# Altium schematic sheet Lockbox_Schematic_V0.4.SchDoc
size A; SheetNumber: 1; SheetTotal: 1
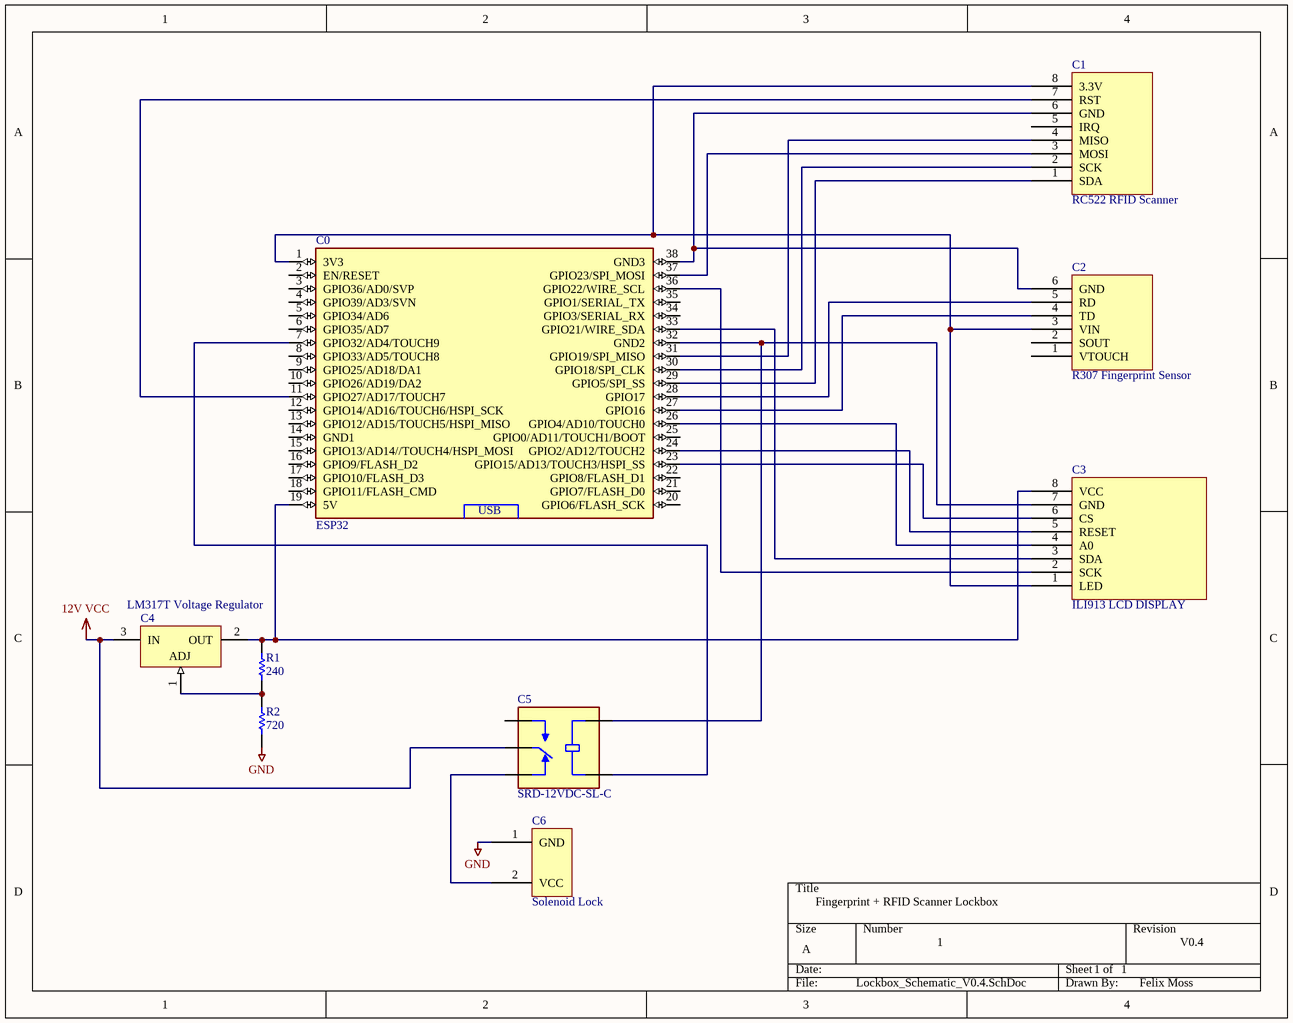
[diagram p0: Lockbox_Schematic_V0.4.SchDoc]

## Parts
C0  ESP32  [ESP32-DEVKITC]
C1  RC522 RFID Scanner
C2  R307 Fingerprint Sensor
C3  ILI913 LCD DISPLAY
C4  LM317T Voltage Regulator  [TO-220]
C5  SRD-12VDC-SL-C  [RELAY_SRD-12VDC-SL-C]
C6  Solenoid Lock  (mechanical)
R1  value 240  (hidden comment: Resistor)
R2  value 720  (hidden comment: Resistor)

## Nets
12V VCC: C4.3(IN) C5.COM
GND: C6.1(GND) R2.1
NetC0_1: C0.1(3V3) C1.8(3.3V) C2.3(VIN) C3.1(LED)
NetC0_7: C0.7(GPIO32/AD4/TOUCH9) C5.COIL1
NetC0_11: C0.11(GPIO27/AD17/TOUCH7) C1.7(RST)
NetC0_19: C0.19(5V) C3.8(VCC) C4.2(OUT) R1.1
NetC0_23: C0.23(GPIO15/AD13/TOUCH3/HSPI_SS) C3.6(CS)
NetC0_24: C0.24(GPIO2/AD12/TOUCH2) C3.5(RESET)
NetC0_26: C0.26(GPIO4/AD10/TOUCH0) C3.4(A0)
NetC0_27: C0.27(GPIO16) C2.4(TD)
NetC0_28: C0.28(GPIO17) C2.5(RD)
NetC0_29: C0.29(GPIO5/SPI_SS) C1.1(SDA)
NetC0_30: C0.30(GPIO18/SPI_CLK) C1.2(SCK)
NetC0_31: C0.31(GPIO19/SPI_MISO) C1.4(MISO)
NetC0_32: C0.32(GND2) C3.7(GND) C5.COIL2
NetC0_33: C0.33(GPIO21/WIRE_SDA) C3.3(SDA)
NetC0_36: C0.36(GPIO22/WIRE_SCL) C3.2(SCK)
NetC0_37: C0.37(GPIO23/SPI_MOSI) C1.3(MOSI)
NetC0_38: C0.38(GND3) C1.6(GND) C2.6(GND)
NetC4_1: C4.1(ADJ) R1.2 R2.2
NetC5_NC: C5.NC C6.2(VCC)

Not connected (* = marked no-connect by the designer): C0 2(EN/RESET) 3(GPIO36/AD0/SVP) 4(GPIO39/AD3/SVN) 5(GPIO34/AD6) 6(GPIO35/AD7) 8(GPIO33/AD5/TOUCH8) 9(GPIO25/AD18/DA1) 10(GPIO26/AD19/DA2) 12(GPIO14/AD16/TOUCH6/HSPI_SCK) 13(GPIO12/AD15/TOUCH5/HSPI_MISO) 14(GND1) 15(GPIO13/AD14//TOUCH4/HSPI_MOSI) 16(GPIO9/FLASH_D2) 17(GPIO10/FLASH_D3) 18(GPIO11/FLASH_CMD) 20(GPIO6/FLASH_SCK) 21(GPIO7/FLASH_D0) 22(GPIO8/FLASH_D1) 25(GPIO0/AD11/TOUCH1/BOOT) 34(GPIO3/SERIAL_RX) 35(GPIO1/SERIAL_TX); C1 5(IRQ); C2 1(VTOUCH) 2(SOUT); C5 NO

## Notes on the sheet
- Fingerprint + RFID Scanner Lockbox
- 1
- V0.4
- Felix Moss
- (in symbol ESP32-DEVKITC) USB

## Library data of the parts
C0 = ESP32-DEVKITC: - ESP-WROOM-32 Transceiver; 802.11 b/g/n (Wi-Fi, WiFi, WLAN), BluetoothÂ® Smart 4.x Low Energy (BLE) 2.4GHz Evaluation Board; MF: Espressif Systems; Package: None; Price: None; Value: *; SnapEDA_Link: https://www.snapeda.com/parts/ESP32-DevKitC/Espressif+Systems/view-part/?ref=snap; MP: ESP32-DevKitC; Availability: In Stock; Check_prices: https://www.snapeda.com/parts/ESP32-DevKitC/Espressif+Systems/view-part/?ref=eda
C1 = RFID-RC522: RFID Scanner
C2 = Fingerprint Sensor: Fingerprint Sensor Powered by AS608
C3 = LCD TFT DISPLAY: LCD-1217
C4 = CMP-0244-00444-1: 1.5A, 1.2V to 37V Adjustable Voltage Regulator, 3-Pin TO-220; PackageVersion: 2011; ComponentLink1URL: http://www.st.com; ComponentLink2URL: http://www.st.com/internet/com/TECHNICAL_RESOURCES/TECHNICAL_LITERATURE/DATASHEET/CD00000455.pdf; PackageDescription: TO, Thru-Hole, Vertical, Heatsink Mounted; 3 In-Line Leads; Pitch 2.54 mm; PackageReference: TO-220; ComponentLink1Description: Manufacturer URL; ComponentLink3URL: http://www.st.com/internet/com/TECHNICAL_RESOURCES/TECHNICAL_LITERATURE/PACKAGE_INFORMATION/CD00004649.pdf; DatasheetVersion: 1/11/2011; ComponentLink2Description: Datasheet; ComponentLink3Description: Package Specification
C5 = SRD-12VDC-SL-C: General Purpose Non Latching 12VDC SPDT Through Hole Relays RoHS; Price: None; Package: None; Availability: Unavailable; MP: SRD-12VDC-SL-C; Value: *
C6 = Solenoid Lock: 12V 1.1A Solenoid Lock
R1 R2 = Resistor: TC1: 0; SimulationGenericComponent: True; TC2: 0